# EAGLE schematic Pyr0-Piezo-FFC-Direct-Creality-X-Board.2.0.1 (EAGLE 9.3.2)
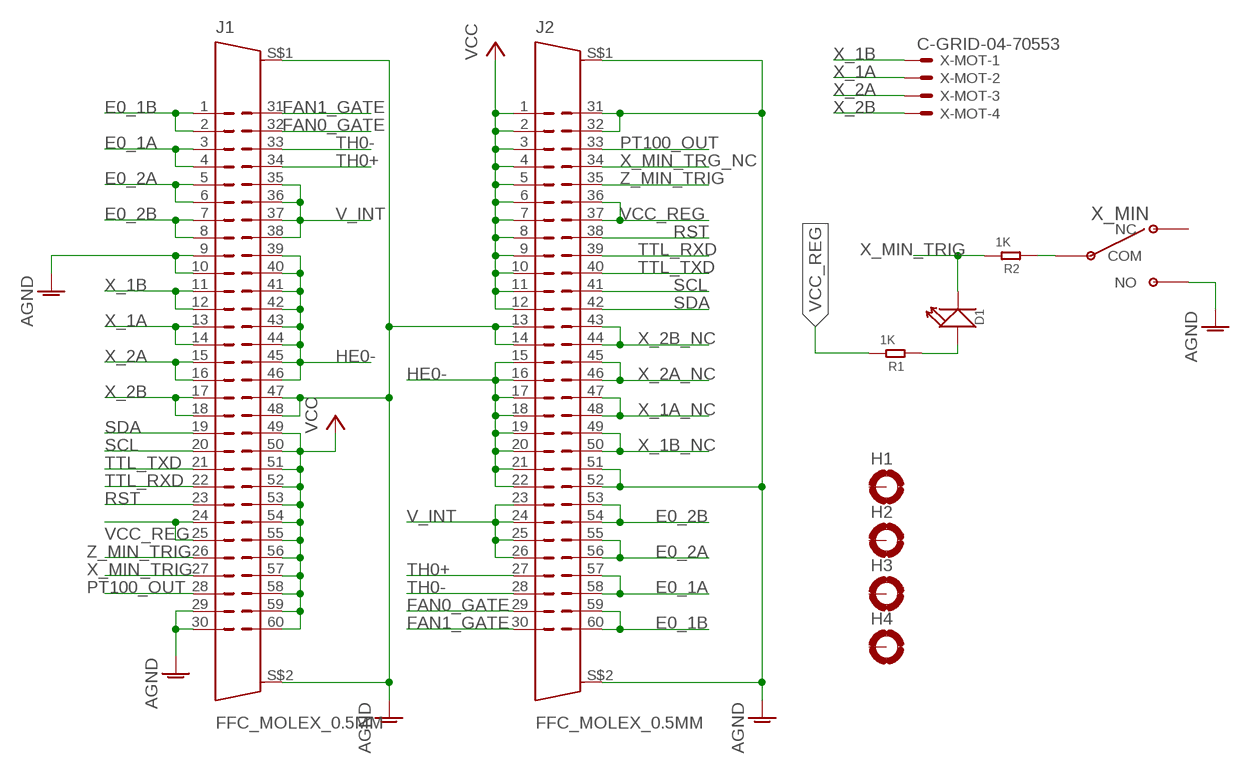
[diagram p0: schematic, sheet 1]

## Parts
D1  SEEED-LED_SMD-LED-CLEAR-BLUE(0603)LED_0603  [SEEED-LED_LED-0603]
H1  HOLES_MOUNT-PAD-ROUND3.2  [HOLES_3,2-PAD]
H2  HOLES_MOUNT-PAD-ROUND3.2  [HOLES_3,2-PAD]
H3  HOLES_MOUNT-PAD-ROUND3.2  [HOLES_3,2-PAD]
H4  HOLES_MOUNT-PAD-ROUND3.2  [HOLES_3,2-PAD]
J1  FFC_MOLEX_0.5MM  [FFC-60P_0.5_MOLEX_505110-6091]
J2  FFC_MOLEX_0.5MM  [FFC-60P_0.5_MOLEX_505110-6091]
R1  1K  SMD-RES-2K-5%-1/8W(0805)  [R0805]
R2  1K  SMD-RES-2K-5%-1/8W(0805)  [R0805]
X-MOT  C-GRID-04-70553  [70553-04]
X_MIN  LIMIT_SWITCHMICRO_SPDT_5.08  [MICROSWITCH_5.08]

## Nets
AGND: J1.9 J1.10 J1.29 J1.30 J1.47 J1.48 J1.S$1(S) J1.S$2(S) J2.13 J2.14 J2.31 J2.32 J2.51 J2.52 J2.S$1(S) J2.S$2(S) X_MIN.P$2(NO)
E0_1A: J1.3 J1.4 J2.57 J2.58
E0_1B: J1.1 J1.2 J2.59 J2.60
E0_2A: J1.5 J1.6 J2.55 J2.56
E0_2B: J1.7 J1.8 J2.53 J2.54
FAN0_GATE: J1.32 J2.29
FAN1_GATE: J1.31 J2.30
HE0-: J1.39 J1.40 J1.41 J1.42 J1.43 J1.44 J1.45 J1.46 J2.15 J2.16 J2.17 J2.18 J2.19 J2.20 J2.21 J2.22
PT100_OUT: J1.28 J2.33
RST: J1.23 J2.38
SCL: J1.20 J2.41
SDA: J1.19 J2.42
TH0+: J1.34 J2.27
TH0-: J1.33 J2.28
TTL_RXD: J1.22 J2.39
TTL_TXD: J1.21 J2.40
V_INT: J1.35 J1.36 J1.37 J1.38 J2.23 J2.24 J2.25 J2.26
VCC: J1.49 J1.50 J1.51 J1.52 J1.53 J1.54 J1.55 J1.56 J1.57 J1.58 J1.59 J1.60 J2.1 J2.2 J2.3 J2.4 J2.5 J2.6 J2.7 J2.8 J2.9 J2.10 J2.11 J2.12
VCC_REG: J1.24 J1.25 J2.36 J2.37 R1.2
X_1A: J1.13 J1.14 X-MOT.2
X_1A_NC: J2.47 J2.48
X_1B: J1.11 J1.12 X-MOT.1
X_1B_NC: J2.49 J2.50
X_2A: J1.15 J1.16 X-MOT.3
X_2A_NC: J2.45 J2.46
X_2B: J1.17 J1.18 X-MOT.4
X_2B_NC: J2.43 J2.44
X_MIN_LED: D1.+ R1.1
X_MIN_TRG_NC: J2.34
X_MIN_TRIG: D1.- J1.27 R2.2
X_PULLDOWN: R2.1 X_MIN.P$1(COM)
Z_MIN_TRIG: J1.26 J2.35
Unconnected: H1.B3,2(MOUNT) H2.B3,2(MOUNT) H3.B3,2(MOUNT) H4.B3,2(MOUNT) X_MIN.P$3(NC)

## Library data of the parts
D1 = PiezoFFC:SEEED-LED_SMD-LED-CLEAR-BLUE(0603): 304090045
H1-H4 = PiezoFFC:HOLES_MOUNT-PAD-ROUND: MOUNTING PAD, round
J1 J2 = PiezoFFC:FFC_MOLEX_0.5MM
R1 R2 = PiezoFFC:SMD-RES-2K-5%-1/8W(0805): 301010318; MPN: RC0805JR-072KL; VALUE: 2K
X-MOT = PiezoFFC:C-GRID-04: CONNECTOR wire to board 2.54 mm (0.100") pitch header; MF: MOLEX; OC_FARNELL: unknown; OC_NEWARK: unknown
X_MIN = PiezoFFC:LIMIT_SWITCH